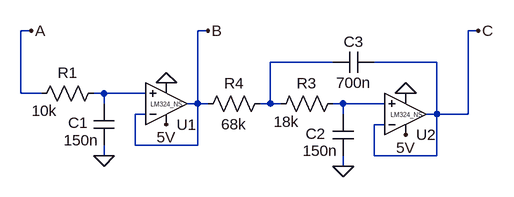
[diagram p0: schematic main.asc]
main.asc, the LTspice schematic file:
Version 4
SHEET 1 1008 680
WIRE 96 -112 80 -112
WIRE 368 -112 352 -112
WIRE 784 -112 768 -112
WIRE 560 -64 464 -64
WIRE 720 -64 624 -64
WIRE 80 -16 80 -112
WIRE 112 -16 80 -16
WIRE 208 -16 192 -16
WIRE 272 -16 208 -16
WIRE 208 0 208 -16
WIRE 352 0 352 -112
WIRE 352 0 336 0
WIRE 368 0 352 0
WIRE 464 0 464 -64
WIRE 464 0 448 0
WIRE 480 0 464 0
WIRE 576 0 560 0
WIRE 640 0 576 0
WIRE 272 16 256 16
WIRE 576 16 576 0
WIRE 720 16 720 -64
WIRE 720 16 704 16
WIRE 768 16 768 -112
WIRE 768 16 720 16
WIRE 640 32 624 32
WIRE 256 64 256 16
WIRE 352 64 352 0
WIRE 352 64 256 64
WIRE 208 80 208 64
WIRE 624 80 624 32
WIRE 720 80 720 16
WIRE 720 80 624 80
WIRE 576 96 576 80
FLAG 304 -32 0
FLAG 304 32 5V
FLAG 96 -112 A
FLAG 368 -112 B
FLAG 208 80 0
FLAG 672 -16 0
FLAG 672 48 5V
FLAG 576 96 0
FLAG 784 -112 C
SYMBOL EXTRA\\ExtraOpamps\\LM324_NS 304 0 M180
WINDOW 3 -24 -1 Left 0
SYMATTR InstName U1
SYMBOL res 96 0 R270
WINDOW 0 32 56 VTop 2
WINDOW 3 5 20 VBottom 2
SYMATTR InstName R1
SYMATTR Value 10k
SYMBOL cap 224 64 R180
WINDOW 0 40 35 Left 2
WINDOW 3 24 8 Left 2
SYMATTR InstName C1
SYMATTR Value 150n
SYMBOL EXTRA\\ExtraOpamps\\LM324_NS 672 16 M180
WINDOW 3 -23 -1 Left 0
SYMATTR InstName U2
SYMBOL res 464 16 R270
WINDOW 0 32 56 VTop 2
WINDOW 3 4 25 VBottom 2
SYMATTR InstName R3
SYMATTR Value 18k
SYMBOL cap 592 80 R180
WINDOW 0 43 34 Left 2
WINDOW 3 24 8 Left 2
SYMATTR InstName C2
SYMATTR Value 150n
SYMBOL cap 624 -80 R90
WINDOW 0 0 32 VBottom 2
WINDOW 3 32 32 VTop 2
SYMATTR InstName C3
SYMATTR Value 700n
SYMBOL res 352 16 R270
WINDOW 0 32 56 VTop 2
WINDOW 3 0 56 VBottom 2
SYMATTR InstName R4
SYMATTR Value 68k

The netlist it stands for:
* main.asc
* U1: LM324_NS (symbol EXTRA\ExtraOpamps\LM324_NS not available, pins judged from their places): In+=N002 In-=B V+=5V V-=0 OUT=B
R1 A N002 10k
C1 0 N002 150n
* U2: LM324_NS (symbol EXTRA\ExtraOpamps\LM324_NS not available, pins judged from their places): In+=N003 In-=C V+=5V V-=0 OUT=C
R3 N001 N003 18k
C2 0 N003 150n
C3 C N001 700n
R4 B N001 68k
.backanno
.end